# Altium project ODOGRAPH.PRJPCB
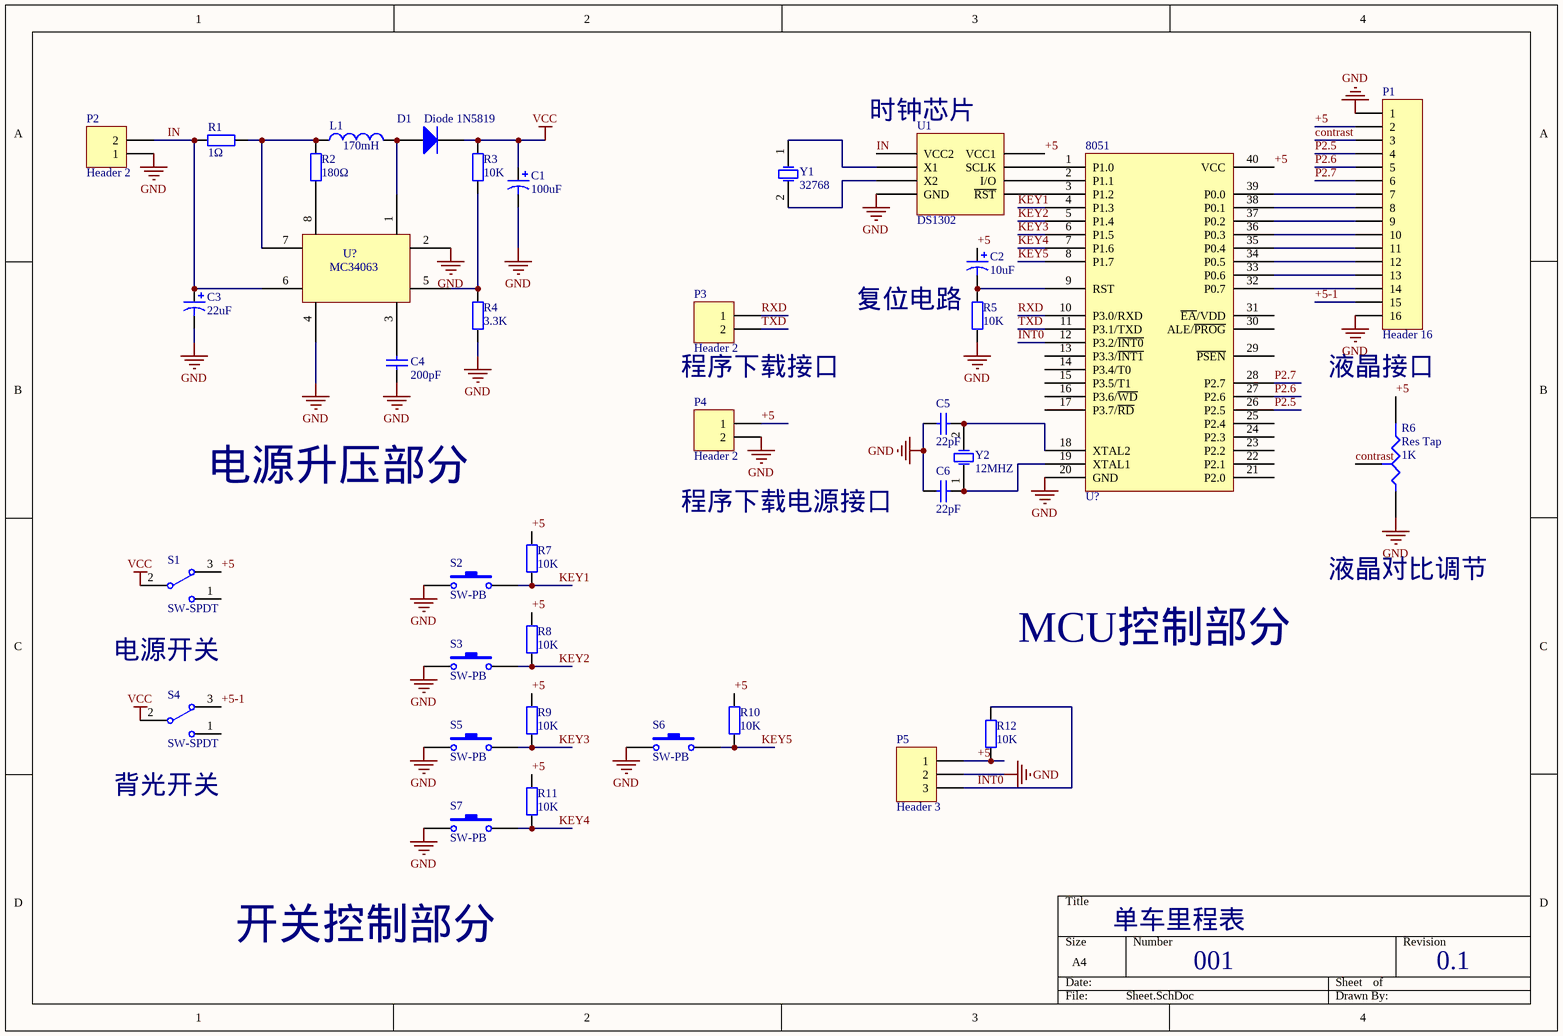
[diagram p0: Sheet.SchDoc]
1 sheet, 37 parts. Net scope: global (net labels, ports and power ports of the same name join across sheets).
Board file: PCB.PcbDoc

## Sheet Sheet.SchDoc: 单车里程表
size A4; Revision: 0.1; SheetNumber: 001

### Parts
8051  U?  [DIP-40]
C1  value 100uF  [CAP-.1/.3]  (hidden comment: Cap Pol1)
C2  value 10uF  [CAP-.1/.2]  (hidden comment: Cap Pol1)
C3  value 22uF  [CAP-.1/.2]  (hidden comment: Cap Pol1)
C4  value 200pF  [CAP]  (hidden comment: Cap)
C5  value 22pF  [CAP]  (hidden comment: Cap)
C6  value 22pF  [CAP]  (hidden comment: Cap)
D1  Diode 1N5819  [DO-41]
L1  value 170mH  [Inductor]  (hidden comment: Inductor)
MC34063  U?  [DIP-8]
P1  Header 16  [HDR1X16]
P2  Header 2  [HDR1X2]
P3  Header 2  [HDR1X2]
P4  Header 2  [HDR1X2]
P5  Header 3  [HDR1X3]
R1  value 1Ω  [AXIAL-0.4]  (hidden comment: Res2)
R2  value 180Ω  [AXIAL-0.4]  (hidden comment: Res2)
R3  value 10K  [AXIAL-0.4]  (hidden comment: Res2)
R4  value 3.3K  [AXIAL-0.4]  (hidden comment: Res2)
R5  value 10K  [AXIAL-0.4]  (hidden comment: Res2)
R6  Res Tap  value 1K  [RW]
R7  value 10K  [AXIAL-0.4]  (hidden comment: Res2)
R8  value 10K  [AXIAL-0.4]  (hidden comment: Res2)
R9  value 10K  [AXIAL-0.4]  (hidden comment: Res2)
R10  value 10K  [AXIAL-0.4]  (hidden comment: Res2)
R11  value 10K  [AXIAL-0.4]  (hidden comment: Res2)
R12  value 10K  [AXIAL-0.4]  (hidden comment: Res2)
S1  SW-SPDT  [SW-6]
S2  SW-PB  [Switch-12/12]
S3  SW-PB  [Switch-12/12]
S4  SW-SPDT  [SW-6]
S5  SW-PB  [Switch-12/12]
S6  SW-PB  [Switch-12/12]
S7  SW-PB  [Switch-12/12]
U1  DS1302  [DIP-8]
Y1  32768  [R38]
Y2  12MHZ  [XTAL]

### Nets
GND: 8051.20(GND) C1.2 C3.2 C4.1 C5.2 C6.2 MC34063.2(Switch_Emitter) MC34063.4(GND) P1.1 P1.16 P2.1 P4.2 P5.2 R4.1 R5.1 R6.1(A) S2.1 S3.1 S5.1 S6.1 S7.1 U1.4(GND)
VCC: C1.1 D1.2(K) R3.2 S1.2 S4.2
+5: 8051.40(VCC) C2.1 P1.2 P4.1 P5.1 R6.2(B) R7.2 R8.2 R9.2 R10.2 R11.2 R12.2 S1.3 U1.8(VCC1)
+5-1: P1.15 S4.3
contrast: P1.3 R6.3(TAP)
IN: C3.1 MC34063.6(VCC) P2.2 R1.1 U1.1(VCC2)
INT0: 8051.12(P3.2/~{INT0}) P5.3 R12.1
KEY1: 8051.4(P1.3) R7.1 S2.2
KEY2: 8051.5(P1.4) R8.1 S3.2
KEY3: 8051.6(P1.5) R9.1 S5.2
KEY4: 8051.7(P1.6) R11.1 S7.2
KEY5: 8051.8(P1.7) R10.1 S6.2
P2.5: 8051.26(P2.5) P1.4
P2.6: 8051.27(P2.6) P1.5
P2.7: 8051.28(P2.7) P1.6
RXD: 8051.10(P3.0/RXD) P3.1
TXD: 8051.11(P3.1/TXD) P3.2
Net8051_1: 8051.1(P1.0) U1.7(SCLK)
Net8051_2: 8051.2(P1.1) U1.6(I/O)
Net8051_3: 8051.3(P1.2) U1.5(~{RST})
Net8051_9: 8051.9(RST) C2.2 R5.2
Net8051_18: 8051.18(XTAL2) C5.1 Y2.2(OSC2)
Net8051_19: 8051.19(XTAL1) C6.1 Y2.1(OSC1)
Net8051_32: 8051.32(P0.7) P1.14
Net8051_33: 8051.33(P0.6) P1.13
Net8051_34: 8051.34(P0.5) P1.12
Net8051_35: 8051.35(P0.4) P1.11
Net8051_36: 8051.36(P0.3) P1.10
Net8051_37: 8051.37(P0.2) P1.9
Net8051_38: 8051.38(P0.1) P1.8
Net8051_39: 8051.39(P0.0) P1.7
NetC4_2: C4.2 MC34063.3(Timing_Capacitor)
NetD1_1: D1.1(A) L1.2 MC34063.1(Switch_Collector)
NetL1_1: L1.1 MC34063.7(Ipk) R1.2 R2.1
NetMC34063_5: MC34063.5(Comparator_Inverting_Input) R3.1 R4.2
NetMC34063_8: MC34063.8(Driver_Collector) R2.2
NetU1_2: U1.2(X1) Y1.1(OSC1)
NetU1_3: U1.3(X2) Y1.2(OSC2)

Not connected (* = marked no-connect by the designer): 8051 13(P3.3/~{INT1}) 14(P3.4/T0) 15(P3.5/T1) 16(P3.6/~{WD}) 17(P3.7/~{RD}) 21(P2.0) 22(P2.1) 23(P2.2) 24(P2.3) 25(P2.4) 29(~{PSEN}) 30(ALE/~{PROG}) 31(~{EA}/VDD); S1 1; S4 1

### Notes on the sheet
- (near U1) 时钟芯片
- 复位电路
- 程序下载接口
- 液晶接口
- 电源升压部分
- (near P4) 程序下载电源接口
- 液晶对比调节
- MCU控制部分
- 电源开关
- (near S4) 背光开关
- 开关控制部分

### Library data of the parts
8051 = 8051
C1-C3 = Cap Pol1: Polarized Capacitor (Radial); Published: 8-Jun-2000; LatestRevisionDate: 17-Jul-2002; LatestRevisionNote: Re-released for DXP Platform.; PackageReference: RB7.6-15; Publisher: Altium Limited
C4-C6 = Cap: Capacitor; Published: 8-Jun-2000; LatestRevisionDate: 17-Jul-2002; LatestRevisionNote: Re-released for DXP Platform.; PackageReference: RAD-0.3; Publisher: Altium Limited
D1 = Diode 1N4001: 1 Amp General Purpose Rectifier; Published: 8-Jun-2000; LatestRevisionDate: 17-Jul-2002; LatestRevisionNote: Re-released for DXP Platform.; DatasheetDocument: 1998; PackageDocument: Aug-1999; PackageReference: DO-41; Publisher: Altium Limited; Code_JEDEC: DO-204-AL; ComponentLink1Description: Manufacturer Link; ComponentLink1URL: http://www.fairchildsemi.com/; ComponentLink2Description: Datasheet; ComponentLink2URL: http://www.fairchildsemi.com/ds/1N%2F1N4001.pdf
L1 = Inductor: Code_IEC: 1005; Published: 8-Jun-2000; LatestRevisionDate: 17-Jul-2002; LatestRevisionNote: Re-released for DXP Platform.; PackageReference: 0402-A; Publisher: Altium Limited; Code_JEITA: 0402
MC34063 = MC34063
P1 = Header 16: Header, 16-Pin; LatestRevisionDate: 17-Jul-2002; LatestRevisionNote: Re-released for DXP Platform.; Publisher: Altium Limited
P2-P4 = Header 2: Header, 2-Pin; LatestRevisionDate: 17-Jul-2002; LatestRevisionNote: Re-released for DXP Platform.; Publisher: Altium Limited
P5 = Header 3: Header, 3-Pin; LatestRevisionDate: 17-Jul-2002; LatestRevisionNote: Re-released for DXP Platform.; Publisher: Altium Limited
R1-R5 R7-R12 = Res2: Resistor; Published: 8-Jun-2000; LatestRevisionDate: 17-Jul-2002; LatestRevisionNote: Re-released for DXP Platform.; PackageReference: AXIAL-0.4; Publisher: Altium Limited
R6 = Res Tap: Tapped Resistor; Sim Note: Enter the Resistance value and the set point into parameter fields.; Set Position: 0.5; Published: 24-Mar-1999; LatestRevisionDate: 17-Jul-2002; LatestRevisionNote: Re-released for DXP Platform.; PackageReference: VR3; Publisher: Altium Limited
S1 S4 = SW-SPDT: SPDT Subminiature Toggle Switch, Right Angle Mounting, Vertical Actuation; Published: 24-Mar-1999; LatestRevisionDate: 17-Dec-2003; LatestRevisionNote: Schematic revised, PCB Footprint replaced.; DatasheetDocument: 05-Dec-2000; PackageReference: TL36WW15050; Publisher: Altium Limited; ComponentLink1Description: Manufacturer Link; ComponentLink1URL: http://www.apem.com
S2 S3 S5-S7 = SW-PB: Switch; Published: 24-Mar-1999; LatestRevisionDate: 17-Jul-2002; LatestRevisionNote: Re-released for DXP Platform.; PackageReference: SPST-2; Publisher: Altium Limited
Y1 Y2 = XTAL: Crystal Oscillator; Published: 8-Jun-2000; LatestRevisionDate: 17-Jul-2002; LatestRevisionNote: Re-released for DXP Platform.; PackageReference: R38; Publisher: Altium Limited